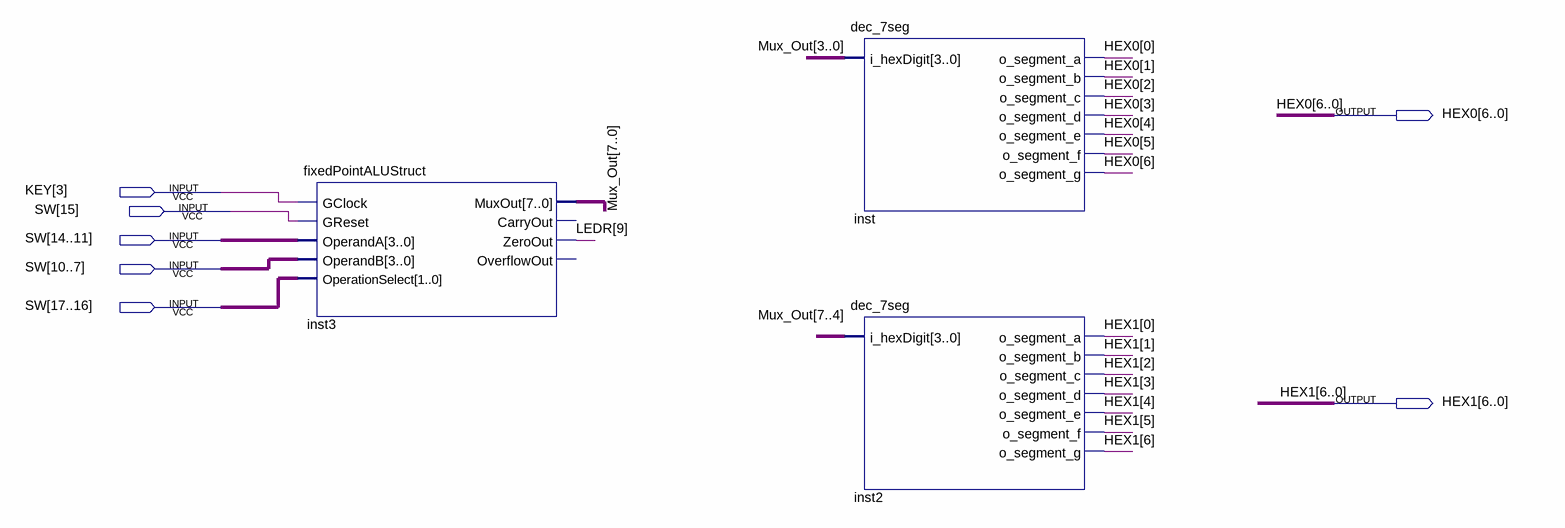
[diagram p0: schematic sheet]
// Quartus schematic CEG-3155-LAB-2-Other.bdf as structural Verilog: 3 symbols, 7 pins
module \CEG-3155-LAB-2-Other  (
  input  [3:3] KEY,
  input  [17:7] SW,
  output [6:0] HEX0,
  output [6:0] HEX1
);

  wire [7:0] Mux_Out;
  wire [9:9] LEDR;

  fixedPointALUStruct inst3 (
    .GClock(KEY[3]), .GReset(SW[15]), .OperandA(SW[14:11]), .OperandB(SW[10:7]), .OperationSelect(SW[17:16]),
    .MuxOut(Mux_Out), .ZeroOut(LEDR[9]));  // open: CarryOut, OverflowOut
  dec_7seg inst (
    .i_hexDigit(Mux_Out[3:0]), .o_segment_a(HEX0[0]), .o_segment_b(HEX0[1]), .o_segment_c(HEX0[2]),
    .o_segment_d(HEX0[3]), .o_segment_e(HEX0[4]), .o_segment_f(HEX0[5]), .o_segment_g(HEX0[6]));
  dec_7seg inst2 (
    .i_hexDigit(Mux_Out[7:4]), .o_segment_a(HEX1[0]), .o_segment_b(HEX1[1]), .o_segment_c(HEX1[2]),
    .o_segment_d(HEX1[3]), .o_segment_e(HEX1[4]), .o_segment_f(HEX1[5]), .o_segment_g(HEX1[6]));
endmodule
